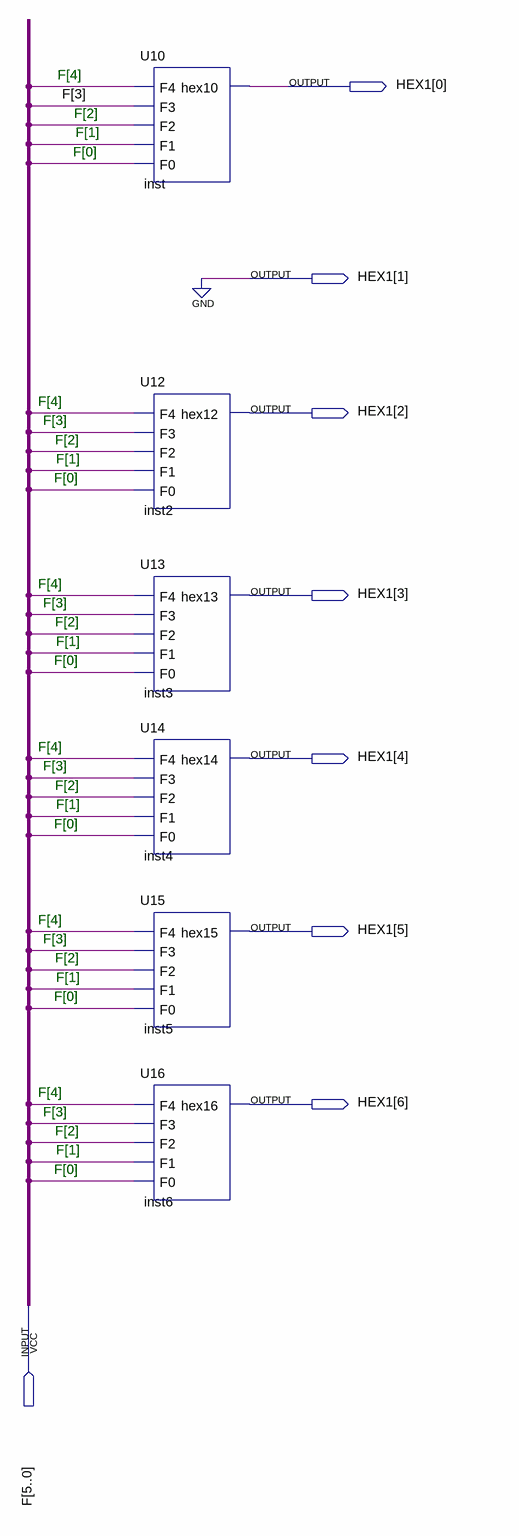
[diagram p0: schematic sheet]
// Quartus schematic Display_7_seg_F1.bdf as structural Verilog: 6 symbols, 8 pins
module Display_7_seg_F1 (
  input  [5:0] F,
  output [6:0] HEX1
);

  U10 inst (.F4(F[4]), .F3(F[3]), .F2(F[2]), .F1(F[1]), .F0(F[0]), .hex10(HEX1[0]));
  U12 inst2 (.F4(F[4]), .F3(F[3]), .F2(F[2]), .F1(F[1]), .F0(F[0]), .hex12(HEX1[2]));
  U13 inst3 (.F4(F[4]), .F3(F[3]), .F2(F[2]), .F1(F[1]), .F0(F[0]), .hex13(HEX1[3]));
  U14 inst4 (.F4(F[4]), .F3(F[3]), .F2(F[2]), .F1(F[1]), .F0(F[0]), .hex14(HEX1[4]));
  U15 inst5 (.F4(F[4]), .F3(F[3]), .F2(F[2]), .F1(F[1]), .F0(F[0]), .hex15(HEX1[5]));
  U16 inst6 (.F4(F[4]), .F3(F[3]), .F2(F[2]), .F1(F[1]), .F0(F[0]), .hex16(HEX1[6]));

  assign HEX1[1] = 1'b0;

  // Notes on the sheet:
  //   F[4]
  //   F[2]
  //   F[1]
  //   F[0]
  //   F[4]
  //   F[3]
  //   F[2]
  //   F[1]
  //   F[0]
  //   F[4]
  //   F[3]
  //   F[2]
  //   F[1]
  //   F[0]
  //   F[4]
  //   F[3]
  //   F[2]
  //   F[1]
  //   F[0]
  //   F[4]
  //   F[3]
  //   F[2]
  //   F[1]
  //   F[0]
  //   F[4]
  //   F[3]
  //   F[2]
  //   F[1]
  //   F[0]
endmodule
